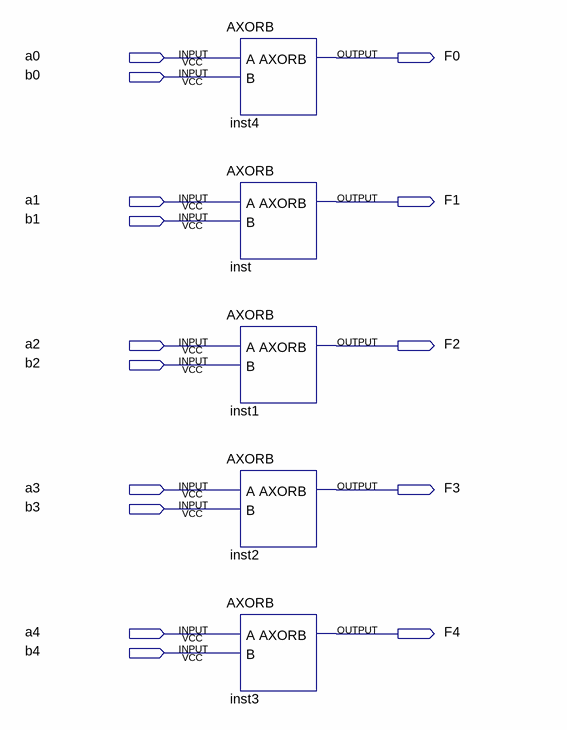
[diagram p0: schematic sheet]
// Quartus schematic 5bitsAXORB.bdf as structural Verilog: 5 symbols, 15 pins
module \5bitsAXORB  (
  input  a0,
  input  b0,
  input  a1,
  input  b1,
  input  a2,
  input  b2,
  input  a3,
  input  b3,
  input  a4,
  input  b4,
  output F0,
  output F1,
  output F2,
  output F3,
  output F4
);

  AXORB inst4 (.A(a0), .B(b0), .AXORB(F0));
  AXORB inst (.A(a1), .B(b1), .AXORB(F1));
  AXORB inst1 (.A(a2), .B(b2), .AXORB(F2));
  AXORB inst2 (.A(a3), .B(b3), .AXORB(F3));
  AXORB inst3 (.A(a4), .B(b4), .AXORB(F4));
endmodule
